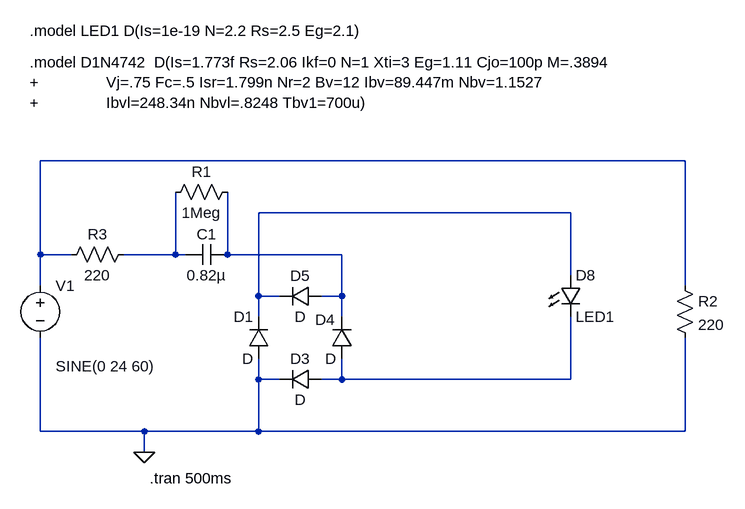
[diagram p0: schematic indicator-led-24vac.asc]
indicator-led-24vac.asc, the LTspice schematic file:
Version 4
SHEET 1 1236 680
WIRE 928 -48 -64 -48
WIRE 752 32 272 32
WIRE -64 96 -64 -48
WIRE -16 96 -64 96
WIRE 144 96 144 0
WIRE 144 96 64 96
WIRE 160 96 144 96
WIRE 224 96 224 0
WIRE 400 96 224 96
WIRE 752 128 752 32
WIRE -64 144 -64 96
WIRE 928 144 928 -48
WIRE 272 160 272 32
WIRE 304 160 272 160
WIRE 400 160 400 96
WIRE 400 160 368 160
WIRE 272 192 272 160
WIRE 400 192 400 160
WIRE 272 288 272 256
WIRE 304 288 272 288
WIRE 400 288 400 256
WIRE 400 288 368 288
WIRE 752 288 752 192
WIRE 752 288 400 288
WIRE -64 368 -64 224
WIRE 96 368 -64 368
WIRE 272 368 272 288
WIRE 272 368 96 368
WIRE 928 368 928 224
WIRE 928 368 272 368
WIRE 96 400 96 368
FLAG 96 400 0
SYMBOL voltage -64 128 R0
WINDOW 3 24 140 Left 2
WINDOW 123 24 118 Left 2
SYMATTR Value SINE(0 24 60)
SYMATTR InstName V1
SYMBOL cap 224 80 R90
WINDOW 0 0 32 VBottom 2
WINDOW 3 32 32 VTop 2
SYMATTR InstName C1
SYMATTR Value 0.82µ
SYMBOL diode 288 256 R180
WINDOW 0 24 64 Left 2
WINDOW 3 24 0 Left 2
SYMATTR InstName D1
SYMBOL res 912 128 R0
SYMATTR InstName R2
SYMATTR Value 220
SYMBOL diode 368 272 R90
WINDOW 0 0 32 VBottom 2
WINDOW 3 32 32 VTop 2
SYMATTR InstName D3
SYMBOL diode 416 256 R180
WINDOW 0 26 60 Left 2
WINDOW 3 24 0 Left 2
SYMATTR InstName D4
SYMBOL diode 368 144 R90
WINDOW 0 0 32 VBottom 2
WINDOW 3 32 32 VTop 2
SYMATTR InstName D5
SYMBOL res 240 -16 R90
WINDOW 0 0 56 VBottom 2
WINDOW 3 32 56 VTop 2
SYMATTR InstName R1
SYMATTR Value 1Meg
SYMBOL res 80 80 R90
WINDOW 0 0 56 VBottom 2
WINDOW 3 32 56 VTop 2
SYMATTR InstName R3
SYMATTR Value 220
SYMBOL LED 736 128 R0
SYMATTR InstName D8
SYMATTR Value LED1
TEXT 104 440 Left 2 !.tran 500ms
TEXT -80 -248 Left 2 !.model LED1 D(Is=1e-19 N=2.2 Rs=2.5 Eg=2.1)
TEXT -80 -200 Left 2 !.model D1N4742  D(Is=1.773f Rs=2.06 Ikf=0 N=1 Xti=3 Eg=1.11 Cjo=100p M=.3894\n+               Vj=.75 Fc=.5 Isr=1.799n Nr=2 Bv=12 Ibv=89.447m Nbv=1.1527\n+               Ibvl=248.34n Nbvl=.8248 Tbv1=700u)

The netlist it stands for:
* indicator-led-24vac.asc
V1 N001 0 SINE(0 24 60)
C1 N004 N003 0.82µ
D1 0 N002 D
R2 N001 0 220
D3 N005 0 D
D4 N005 N004 D
D5 N004 N002 D
R1 N004 N003 1Meg
R3 N003 N001 220
D8 N002 N005 LED1
.model D D
.lib standard.dio
.tran 500ms
.model LED1 D(Is=1e-19 N=2.2 Rs=2.5 Eg=2.1)
.model D1N4742  D(Is=1.773f Rs=2.06 Ikf=0 N=1 Xti=3 Eg=1.11 Cjo=100p M=.3894
+               Vj=.75 Fc=.5 Isr=1.799n Nr=2 Bv=12 Ibv=89.447m Nbv=1.1527
+               Ibvl=248.34n Nbvl=.8248 Tbv1=700u)
.backanno
.end